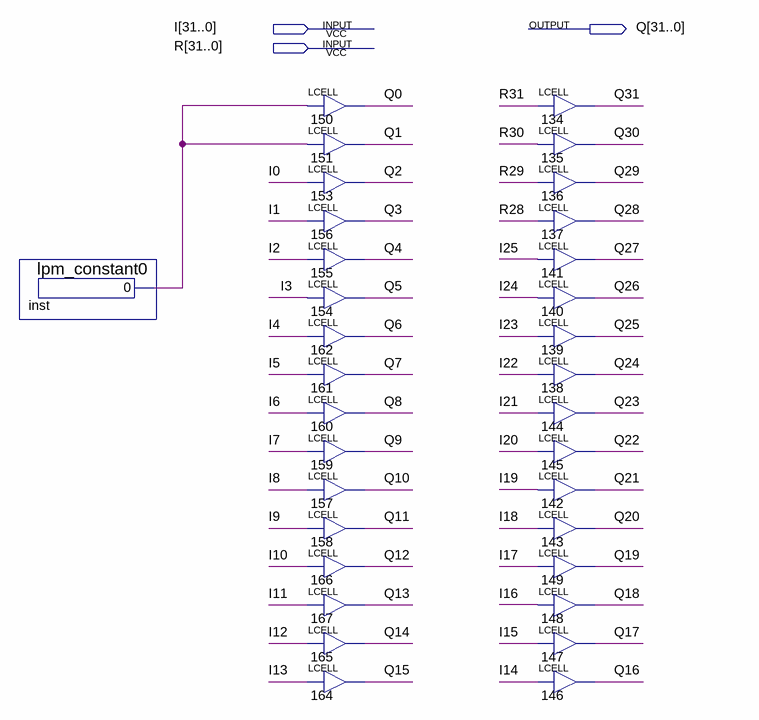
[diagram p0: schematic sheet]
// Quartus schematic ConcatenadorPro.bdf as structural Verilog: 33 symbols, 3 pins
module ConcatenadorPro (
  input  [31:0] I,
  input  [31:0] R,
  output [31:0] Q
);

  wire inst_result;

  lpm_constant0 inst (.result(inst_result));
  LCELL u_150 (.IN(inst_result), .OUT(Q[0]));
  LCELL u_151 (.IN(inst_result), .OUT(Q[1]));
  LCELL u_153 (.IN(I[0]), .OUT(Q[2]));
  LCELL u_156 (.IN(I[1]), .OUT(Q[3]));
  LCELL u_155 (.IN(I[2]), .OUT(Q[4]));
  LCELL u_154 (.IN(I[3]), .OUT(Q[5]));
  LCELL u_162 (.IN(I[4]), .OUT(Q[6]));
  LCELL u_161 (.IN(I[5]), .OUT(Q[7]));
  LCELL u_160 (.IN(I[6]), .OUT(Q[8]));
  LCELL u_159 (.IN(I[7]), .OUT(Q[9]));
  LCELL u_157 (.IN(I[8]), .OUT(Q[10]));
  LCELL u_158 (.IN(I[9]), .OUT(Q[11]));
  LCELL u_166 (.IN(I[10]), .OUT(Q[12]));
  LCELL u_167 (.IN(I[11]), .OUT(Q[13]));
  LCELL u_165 (.IN(I[12]), .OUT(Q[14]));
  LCELL u_164 (.IN(I[13]), .OUT(Q[15]));
  LCELL u_134 (.IN(R[31]), .OUT(Q[31]));
  LCELL u_135 (.IN(R[30]), .OUT(Q[30]));
  LCELL u_136 (.IN(R[29]), .OUT(Q[29]));
  LCELL u_137 (.IN(R[28]), .OUT(Q[28]));
  LCELL u_141 (.IN(I[25]), .OUT(Q[27]));
  LCELL u_140 (.IN(I[24]), .OUT(Q[26]));
  LCELL u_139 (.IN(I[23]), .OUT(Q[25]));
  LCELL u_138 (.IN(I[22]), .OUT(Q[24]));
  LCELL u_144 (.IN(I[21]), .OUT(Q[23]));
  LCELL u_145 (.IN(I[20]), .OUT(Q[22]));
  LCELL u_142 (.IN(I[19]), .OUT(Q[21]));
  LCELL u_143 (.IN(I[18]), .OUT(Q[20]));
  LCELL u_149 (.IN(I[17]), .OUT(Q[19]));
  LCELL u_148 (.IN(I[16]), .OUT(Q[18]));
  LCELL u_147 (.IN(I[15]), .OUT(Q[17]));
  LCELL u_146 (.IN(I[14]), .OUT(Q[16]));
endmodule
